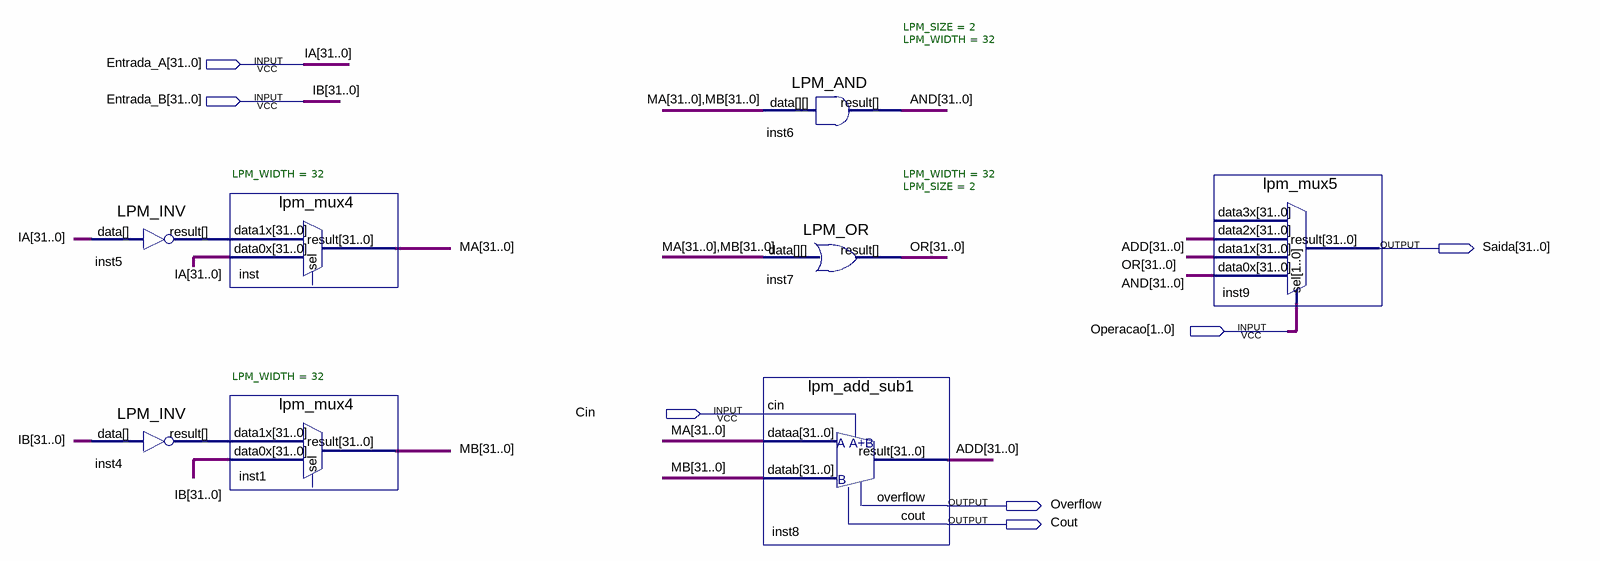
[diagram p0: schematic sheet]
// Quartus schematic TesteULA32.bdf as structural Verilog: 8 symbols, 7 pins
module TesteULA32 (
  input  [31:0] Entrada_A,
  input  [31:0] Entrada_B,
  input  [1:0] Operacao,
  input  Cin,
  output [31:0] Saida,
  output Overflow,
  output Cout
);

  wire [31:0] ADD, AND, inst4_result, inst5_result, MA, MB, OR;

  LPM_INV #(.LPM_WIDTH(32)) inst5 (.data(Entrada_A), .result(inst5_result));
  LPM_INV #(.LPM_WIDTH(32)) inst4 (.data(Entrada_B), .result(inst4_result));
  lpm_mux4 inst (.data1x(inst5_result), .data0x(Entrada_A), .result(MA));  // open: sel
  lpm_mux4 inst1 (.data1x(inst4_result), .data0x(Entrada_B), .result(MB));  // open: sel
  LPM_AND #(.LPM_SIZE(2), .LPM_WIDTH(32)) inst6 (.data({MA, MB}), .result(AND));
  LPM_OR #(.LPM_WIDTH(32), .LPM_SIZE(2)) inst7 (.data({MA, MB}), .result(OR));
  lpm_add_sub1 inst8 (.cin(Cin), .dataa(MA), .datab(MB), .result(ADD), .overflow(Overflow), .cout(Cout));
  lpm_mux5 inst9 (.data2x(ADD), .data1x(OR), .data0x(AND), .sel(Operacao), .result(Saida));  // open: data3x

  // Other names for the same wires on the sheet: IA[31:0] = Entrada_A; IB[31:0] = Entrada_B
endmodule
